# Altium schematic sheet LCLFilter_Updated.SchDoc
size A4; SheetNumber: 1; SheetTotal: 1
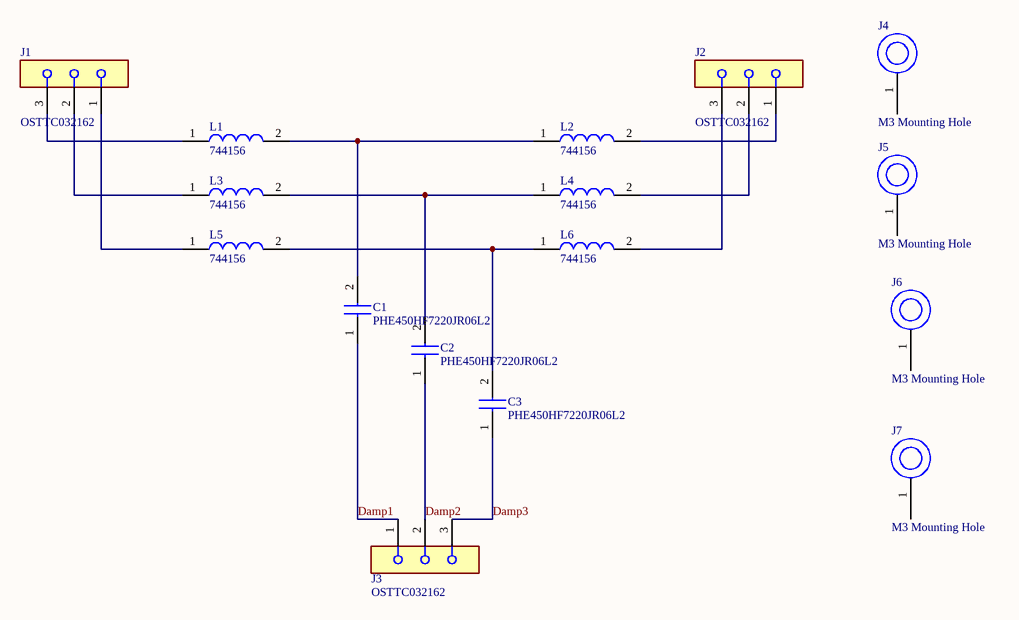
[diagram p0: LCLFilter_Updated.SchDoc]

## Parts
C1  PHE450HF7220JR06L2  [Film Capacitor PHE450HF7220JR06L2]
C2  PHE450HF7220JR06L2  [Film Capacitor PHE450HF7220JR06L2]
C3  PHE450HF7220JR06L2  [Film Capacitor PHE450HF7220JR06L2]
J1  Part Number: OSTTC032162  [3 Pin Terminal]  (hidden comment: 3PinTerminal)
J2  Part Number: OSTTC032162  [3 Pin Terminal]  (hidden comment: 3PinTerminal)
J3  Part Number: OSTTC032162  [3 Pin Terminal]  (hidden comment: 3PinTerminal)
J4  M3 Mounting Hole  [M3 Mounting Hole]
J5  M3 Mounting Hole  [M3 Mounting Hole]
J6  M3 Mounting Hole  [M3 Mounting Hole]
J7  M3 Mounting Hole  [M3 Mounting Hole]
L1  744156  [Toroid Inductor 744156]
L2  744156  [Toroid Inductor 744156]
L3  744156  [Toroid Inductor 744156]
L4  744156  [Toroid Inductor 744156]
L5  744156  [Toroid Inductor 744156]
L6  744156  [Toroid Inductor 744156]

## Nets
Damp1: C1.1 J3.1
Damp2: C2.1 J3.2
Damp3: C3.1 J3.3
NetC1_2: C1.2 L1.2 L2.1
NetC2_2: C2.2 L3.2 L4.1
NetC3_2: C3.2 L5.2 L6.1
NetJ1_1: J1.1 L5.1
NetJ1_2: J1.2 L3.1
NetJ1_3: J1.3 L1.1
NetJ2_1: J2.1 L2.2
NetJ2_2: J2.2 L4.2
NetJ2_3: J2.3 L6.2

Not connected (* = marked no-connect by the designer): J4 1; J5 1; J6 1; J7 1

## Library data of the parts
C1-C3 = PHE450HF7220JR06L2: Capacitor; Manufacturer_Name: KEMET; Datasheet Link: https://docs.rs-online.com/a458/0900766b817170df.pdf; Height: 24.5mm; Manufacturer_Part_Number: PHE450HF7220JR06L2
J1-J3 = 3PinTerminal: 3 Position Terminal Block 5.08mm; Manufacturer: On Shore Technology; Voltage: 300V; Is Female: yes; helpURL: https://upverter.com/upn/revision/2b80058b23306b34/; ComponentLink2Description: Datasheet; Temperature: -30°C to +105°C; Package: HDR03; Supplier 2: Mouser; Price: 0.382016875697; Supplier 1: Digi-Key; ComponentLink1URL: https://upverter.com/upn/revision/2b80058b23306b34/; Supplier Part Number 1: ED2610-ND; ComponentLink1Description: Upverter; ComponentLink2URL: https://upverter.com/datasheet/d9a5d2e095ec14efdc364e45047c257fc4ca76eb.pdf; RoHS: TRUE; Temperature Range High: +105°C; Digikey Description: CONN TERM BLOCK 5.08MM VERT 3POS PCB; Digikey Part Number: ED2610-ND; Lead Free: yes; Temperature Range Low: -30°C
L1-L6 = 744156: Toroidal Inductor, WE-SI, 380 µH, 6.2 A, 0.07 ohm, ± 20%; Manufacturer_Name: Wurth Elektronik; Manufacturer_Part_Number: 744156